# EAGLE design OrmerodController (EAGLE 7.2.0)
PanelDue 1.1
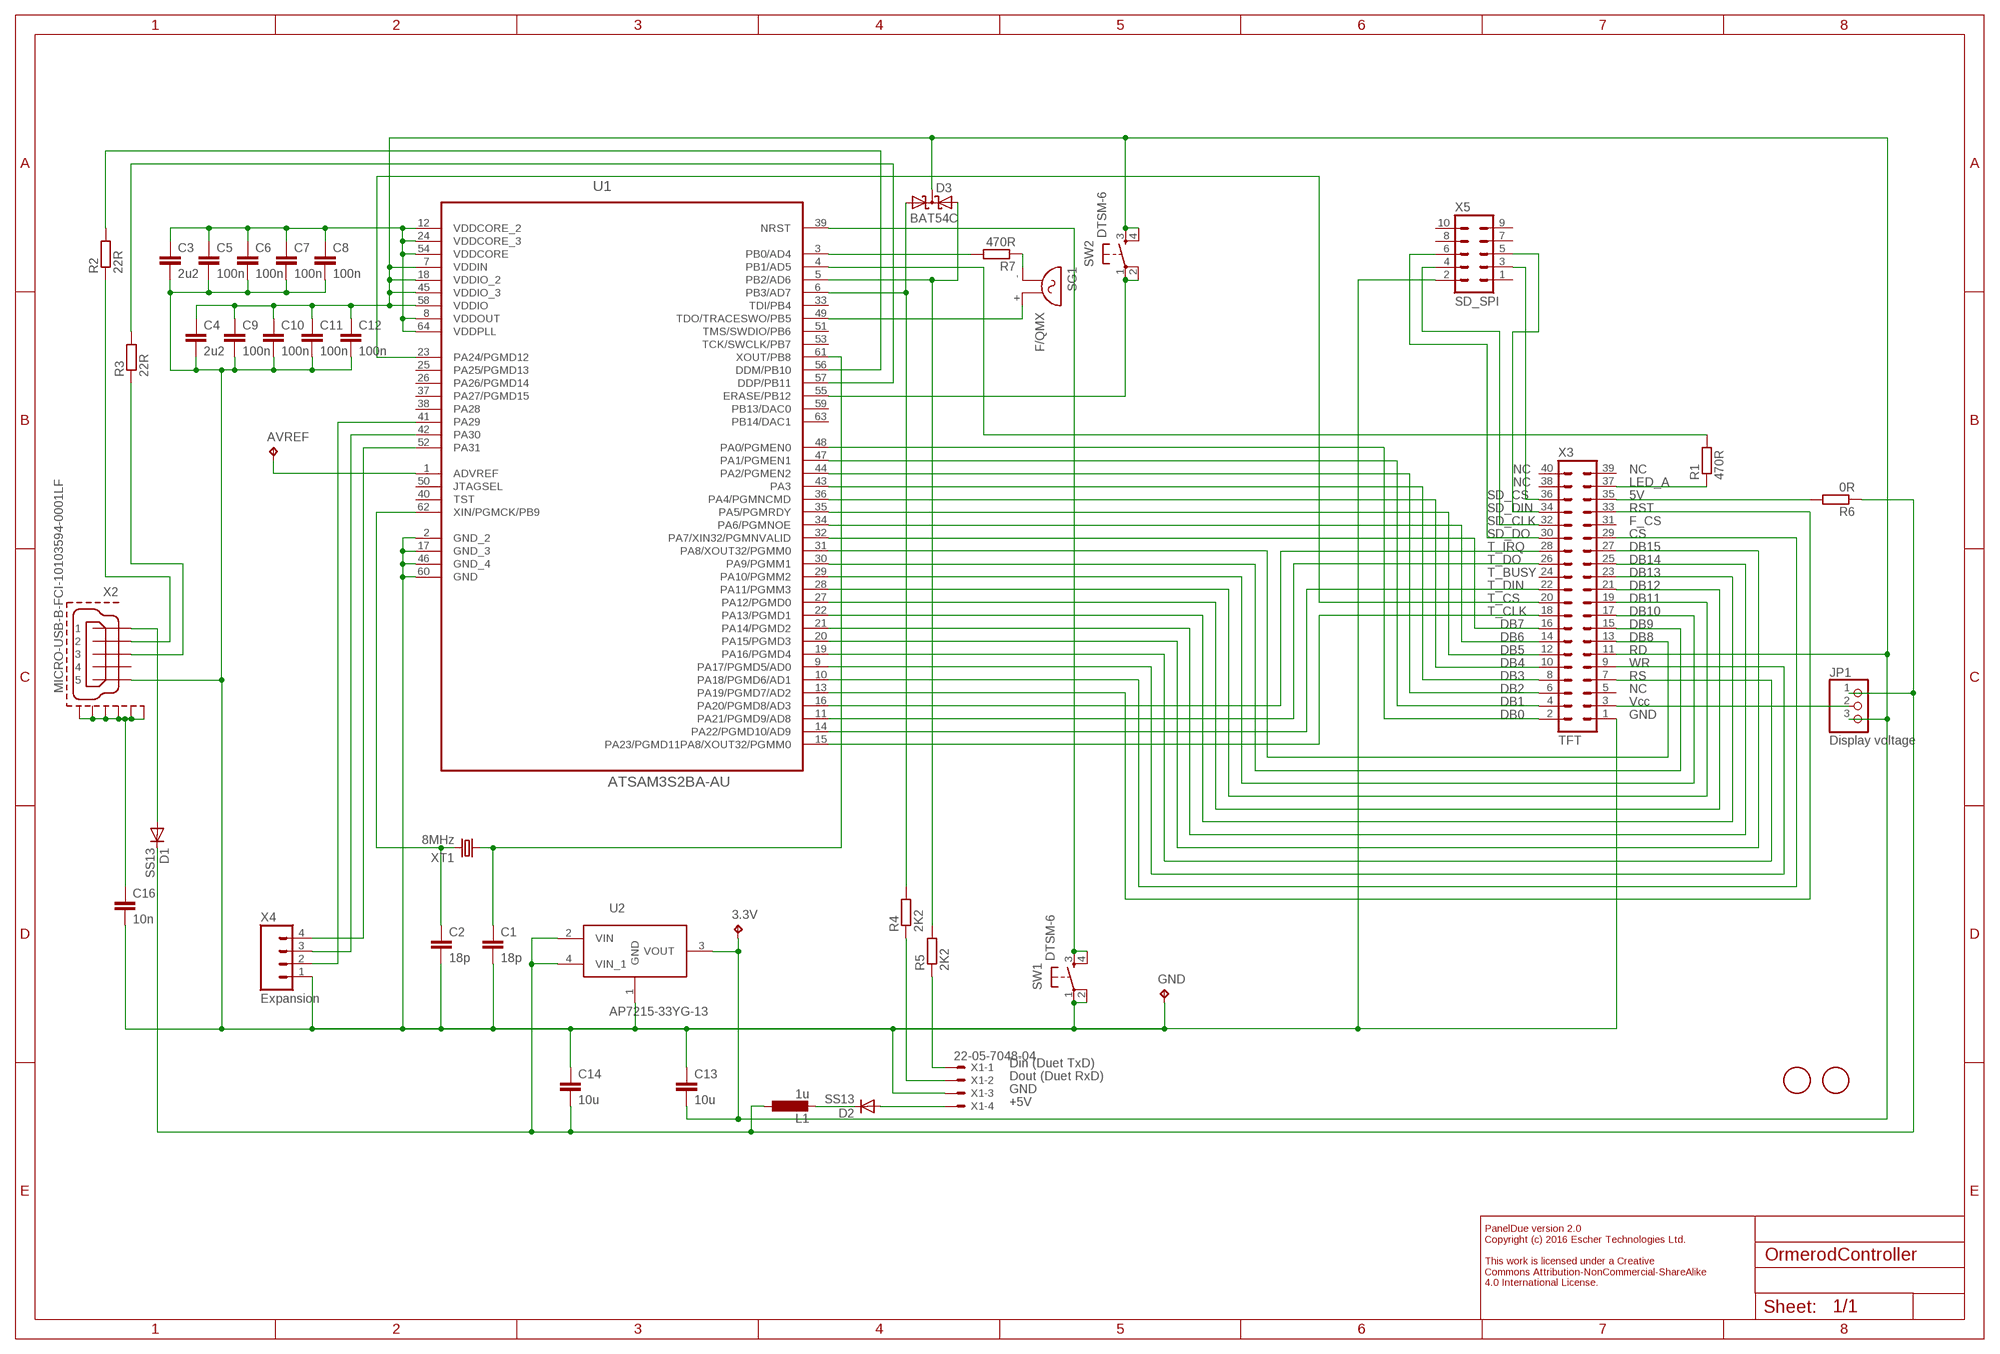
[diagram p0: schematic, sheet 1]

## Parts
3.3V  TPPAD1-10  [P1-10]
AVREF  TPPAD1-10  [P1-10]
C1  18p  C-EUC0603  [C0603]
C2  18p  C-EUC0603  [C0603]
C3  2u2  C-EUC0603  [C0603]
C4  2u2  C-EUC0603  [C0603]
C5  100n  C-EUC0603  [C0603]
C6  100n  C-EUC0603  [C0603]
C7  100n  C-EUC0603  [C0603]
C8  100n  C-EUC0603  [C0603]
C9  100n  C-EUC0603  [C0603]
C10  100n  C-EUC0603  [C0603]
C11  100n  C-EUC0603  [C0603]
C12  100n  C-EUC0603  [C0603]
C13  10u  C-EUC0805  [C0805]
C14  10u  C-EUC0805  [C0805]
C16  10n  C-EUC0603  [C0603]
D1  SS13  DIODE-DO214AC  [DO214AC]
D2  SS13  DIODE-DO214AC  [DO214AC]
D3  BAT54C  [SOT23]
GND  TPPAD1-10  [P1-10]
JP1  Display voltage  PINHD-1X3  [1X03]
L1  1u  L-EUL2012C  [L2012C]
R1  470R  R-EU_R0603  [R0603]
R2  22R  R-EU_R0603  [R0603]
R3  22R  R-EU_R0603  [R0603]
R4  2K2  R-EU_R0603  [R0603]
R5  2K2  R-EU_R0603  [R0603]
R6  0R  R-EU_R0603  [R0603]
R7  470R  R-EU_R0603  [R0603]
SG1  F/QMX  [F/QMX]
SW1  DTSM-6  [DTSM-6]
SW2  DTSM-6  [DTSM-6]
U1  ATSAM3S2BA-AU  [QFP50P1200X1200X160-64N]
U2  AP7215-33YG-13  MCP17-MCP1702T-3302E/MB  [SOT150P400X160-4N]
U$1  FIDUCIAL  [FIDUCIAL_1MM]
U$2  FIDUCIAL  [FIDUCIAL_1MM]
X1  22-05-7048-04  [7395-04]
X2  MICRO-USB-B-FCI-10103594-0001LF  [10103594-0001LF]
X3  TFT  MA20-2  [MA20-2]
X4  Expansion  M04PTH  [1X04]
X5  SD_SPI  ML10L  [ML10L]
XT1  8MHz  CRYSTALHC49UP  [HC49UP]

## Nets
GND: C1.2 C2.2 C3.2 C4.2 C5.2 C6.2 C7.2 C8.2 C9.2 C10.2 C11.2 C12.2 C13.1 C14.1 C16.2 GND.TP SW1.1 SW1.2 U1.2(GND_2) U1.17(GND_3) U1.46(GND_4) U1.60(GND) U2.1(GND) X1.3 X2.5 X3.1 X4.1 X5.2
N$1: U1.48(PA0/PGMEN0) X3.2
N$2: U1.15(PA23/PGMD11PA8/XOUT32/PGMM0) X3.18
N$3: U1.47(PA1/PGMEN1) X3.4
N$4: U1.44(PA2/PGMEN2) X3.6
N$5: U1.36(PA4/PGMNCMD) X3.10
N$6: U1.34(PA6/PGMNOE) X3.14
N$7: U1.35(PA5/PGMRDY) X3.12
N$8: U1.32(PA7/XIN32/PGMNVALID) X3.16
N$9: U1.31(PA8/XOUT32/PGMM0) X3.13
N$10: U1.43(PA3) X3.8
N$11: U1.30(PA9/PGMM1) X3.15
N$12: U1.29(PA10/PGMM2) X3.17
N$13: U1.28(PA11/PGMM3) X3.19
N$14: U1.27(PA12/PGMD0) X3.21
N$15: U1.22(PA13/PGMD1) X3.23
N$16: U1.21(PA14/PGMD2) X3.25
N$17: U1.20(PA15/PGMD3) X3.27
N$18: R2.2 U1.56(DDM/PB10)
N$19: U1.14(PA22/PGMD10/AD9) X3.22
N$20: U1.11(PA21/PGMD9/AD8) X3.26
N$21: C1.1 U1.61(XOUT/PB8) XT1.1
N$22: C2.1 U1.62(XIN/PGMCK/PB9) XT1.2
N$23: SW2.1 SW2.2 U1.55(ERASE/PB12)
N$24: U1.41(PA29) X4.2
N$25: SW1.3 SW1.4 U1.39(NRST)
N$26: D3.2(A2) R5.2 U1.5(PB2/AD6)
N$27: D3.1(A1) R4.2 U1.6(PB3/AD7)
N$28: R3.2 U1.57(DDP/PB11)
N$29: R4.1 X1.2
N$30: R5.1 X1.1
N$31: D1.A X2.1
N$32: R2.1 X2.2
N$33: R7.2 U1.3(PB0/AD4)
N$34: R3.1 X2.3
N$35: U1.23(PA24/PGMD12) X3.20
N$36: U1.16(PA20/PGMD8/AD3) X3.28
N$37: JP1.2 X3.3
N$38: R1.1 X3.37
N$39: X3.36 X5.3
N$40: R7.1 SG1.-
N$41: U1.42(PA30) X4.3
N$42: U1.52(PA31) X4.4
N$43: U1.13(PA19/PGMD7/AD2) X3.33
N$44: U1.10(PA18/PGMD6/AD1) X3.29
N$45: U1.9(PA17/PGMD5/AD0) X3.9
N$46: D2.C L1.2
N$47: C16.1 X2.GND1 X2.GND2 X2.GND3 X2.GND4 X2.GND5 X2.GND6
N$48: U1.19(PA16/PGMD4) X3.7
N$49: AVREF.TP U1.1(ADVREF)
N$50: D2.A X1.4
N$51: X3.34 X5.5
N$52: R1.2 U1.4(PB1/AD5)
N$54: SG1.+ U1.49(TDO/TRACESWO/PB5)
N$55: C3.1 C5.1 C6.1 C7.1 C8.1 U1.8(VDDOUT) U1.12(VDDCORE_2) U1.24(VDDCORE_3) U1.54(VDDCORE) U1.64(VDDPLL)
N$56: X3.32 X5.4
N$57: X3.30 X5.6
N$58: R6.2 X3.35
VCC: 3.3V.TP C4.1 C9.1 C10.1 C11.1 C12.1 C13.2 D3.3(CC) JP1.3 SW2.3 SW2.4 U1.7(VDDIN) U1.18(VDDIO_2) U1.45(VDDIO_3) U1.58(VDDIO) U2.3(VOUT) X3.11
VCC5: C14.2 D1.C JP1.1 L1.1 R6.1 U2.2(VIN) U2.4(VIN_1)
Unconnected: U1.25(PA25/PGMD13) U1.26(PA26/PGMD14) U1.33(TDI/PB4) U1.37(PA27/PGMD15) U1.38(PA28) U1.40(TST) U1.50(JTAGSEL) U1.51(TMS/SWDIO/PB6) U1.53(TCK/SWCLK/PB7) U1.59(PB13/DAC0) U1.63(PB14/DAC1) X2.4 X3.5 X3.24 X3.31 X3.38 X3.39 X3.40 X5.1 X5.7 X5.8 X5.9 X5.10

## Notes on the sheet
- NC | NC
- NC | LED_A
- SD_CS | 5V
- SD_DIN | RST
- SD_CLK | F_CS
- SD_DO | CS
- T_IRQ | DB15
- T_DO | DB14
- T_BUSY | DB13
- T_DIN | DB12
- T_CS | DB11
- T_CLK | DB10
- DB7 | DB9
- DB6 | DB8
- DB5 | RD
- DB4 | WR
- DB3 | RS
- DB2 | NC
- DB1 | Vcc
- DB0 | GND
- Din (Duet TxD)
- Dout (Duet RxD)
- GND
- +5V
- PanelDue version 2.0
  Copyright (c) 2016 Escher Technologies Ltd.
  
  This work is licensed under a Creative
  Commons Attribution-NonCommercial-ShareAlike
  4.0 International License.

## Library data of the parts
3.3V AVREF GND = testpad:TP: Test pad
C1-C14 C16 = resistor:C-EU: CAPACITOR, European symbol
D1 D2 = diode:DIODE-: DIODE
D3 = diode:BAT54C: Schottky Diodes Source: Fairchild .. BAT54.pdf
JP1 = adafruit:PINHD-1X3: PIN HEADER
L1 = resistor:L-EU: INDUCTOR, European symbol
R1-R7 = resistor:R-EU_: RESISTOR, European symbol
SG1 = buzzer:F/QMX: BUZZER Source: Buerklin; OC_FARNELL: unknown; OC_NEWARK: unknown
SW1 SW2 = switch-tact:DTSM-6
U1 = Atmel_By_element14_Batch_1-00:ATSAM3S2BA-AU: Flash MCU; DESCRIPTION: Flash MCU; MPN: ATSAM3S2BA-AU; OC_FARNELL: 1841653; OC_NEWARK: 12T1311; PACKAGE: QFP-64; SUPPLIER: Atmel
U2 = Microchip-MCP170xxxx_MB:MCP17: Low Quiescent Current LDO Regulator; MPN: MCP1702T-3302E/MB; OC_FARNELL: 1605558; OC_NEWARK: 11N7989; PACKAGE: SOT89-3; SUPPLIER: Microchip
U$1 U$2 = adafruit:FIDUCIAL: For use by pick and place machines to calibrate the vision/machine, 1mm By microbuilder.eu
X1 = con-molex:22-?-04: CONNECTOR wire to board 2.54 mm (.1 inch) pitch header; OC_FARNELL: unknown; OC_NEWARK: unknown
X2 = eschertechnologies:MICRO-USB-B-FCI-10103594-0001LF
X3 = con-lstb:MA20-2: PIN HEADER; OC_FARNELL: unknown; OC_NEWARK: unknown
X4 = SparkFun-Connectors:M04: Header 4 Standard 4-pin 0.1" header. Use with straight break away headers (SKU : PRT-00116), right angle break away headers (PRT-00553), swiss pins (PRT-00743), machine pins (PRT-00117), and female headers (PRT-00115). Molex polarized connector foot print use with SKU : PRT-08231 with associated crimp pins and housings. 1MM SMD Version SKU: PRT-10208
X5 = con-ml:ML10L: HARTING; OC_FARNELL: unknown; OC_NEWARK: unknown
XT1 = crystal:CRYSTAL: CRYSTAL; OC_FARNELL: unknown; OC_NEWARK: unknown

## Board
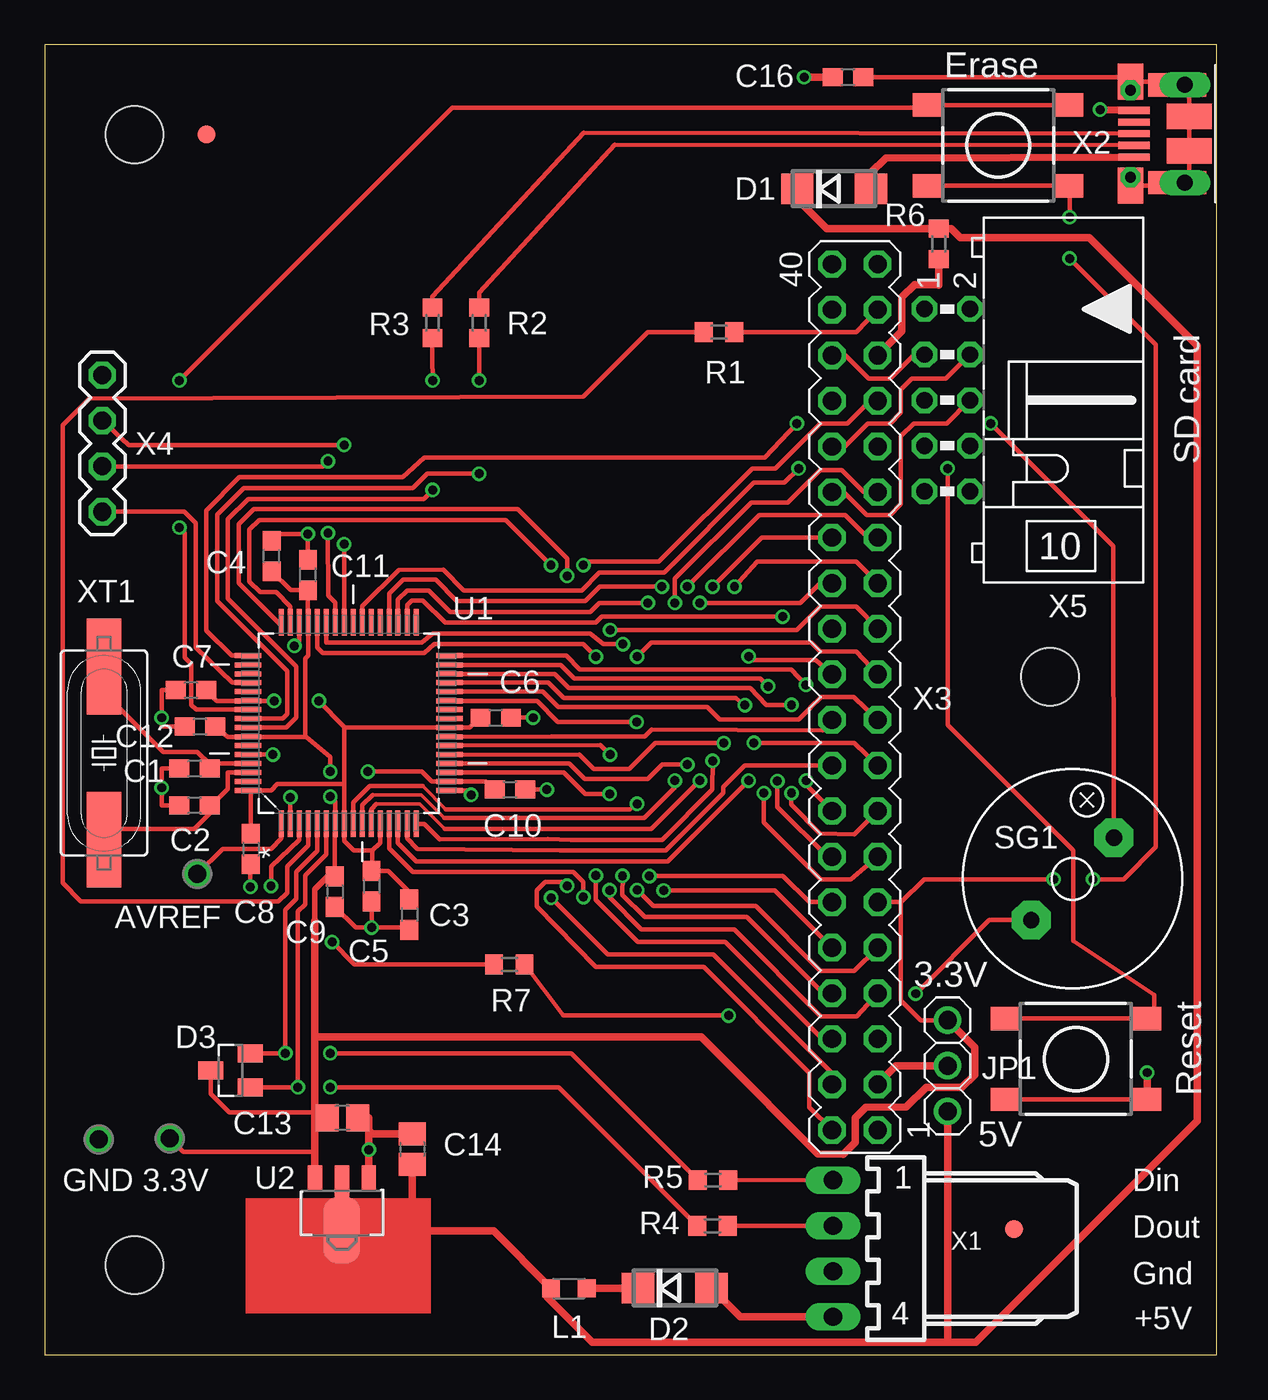
[diagram p1: board, top side]
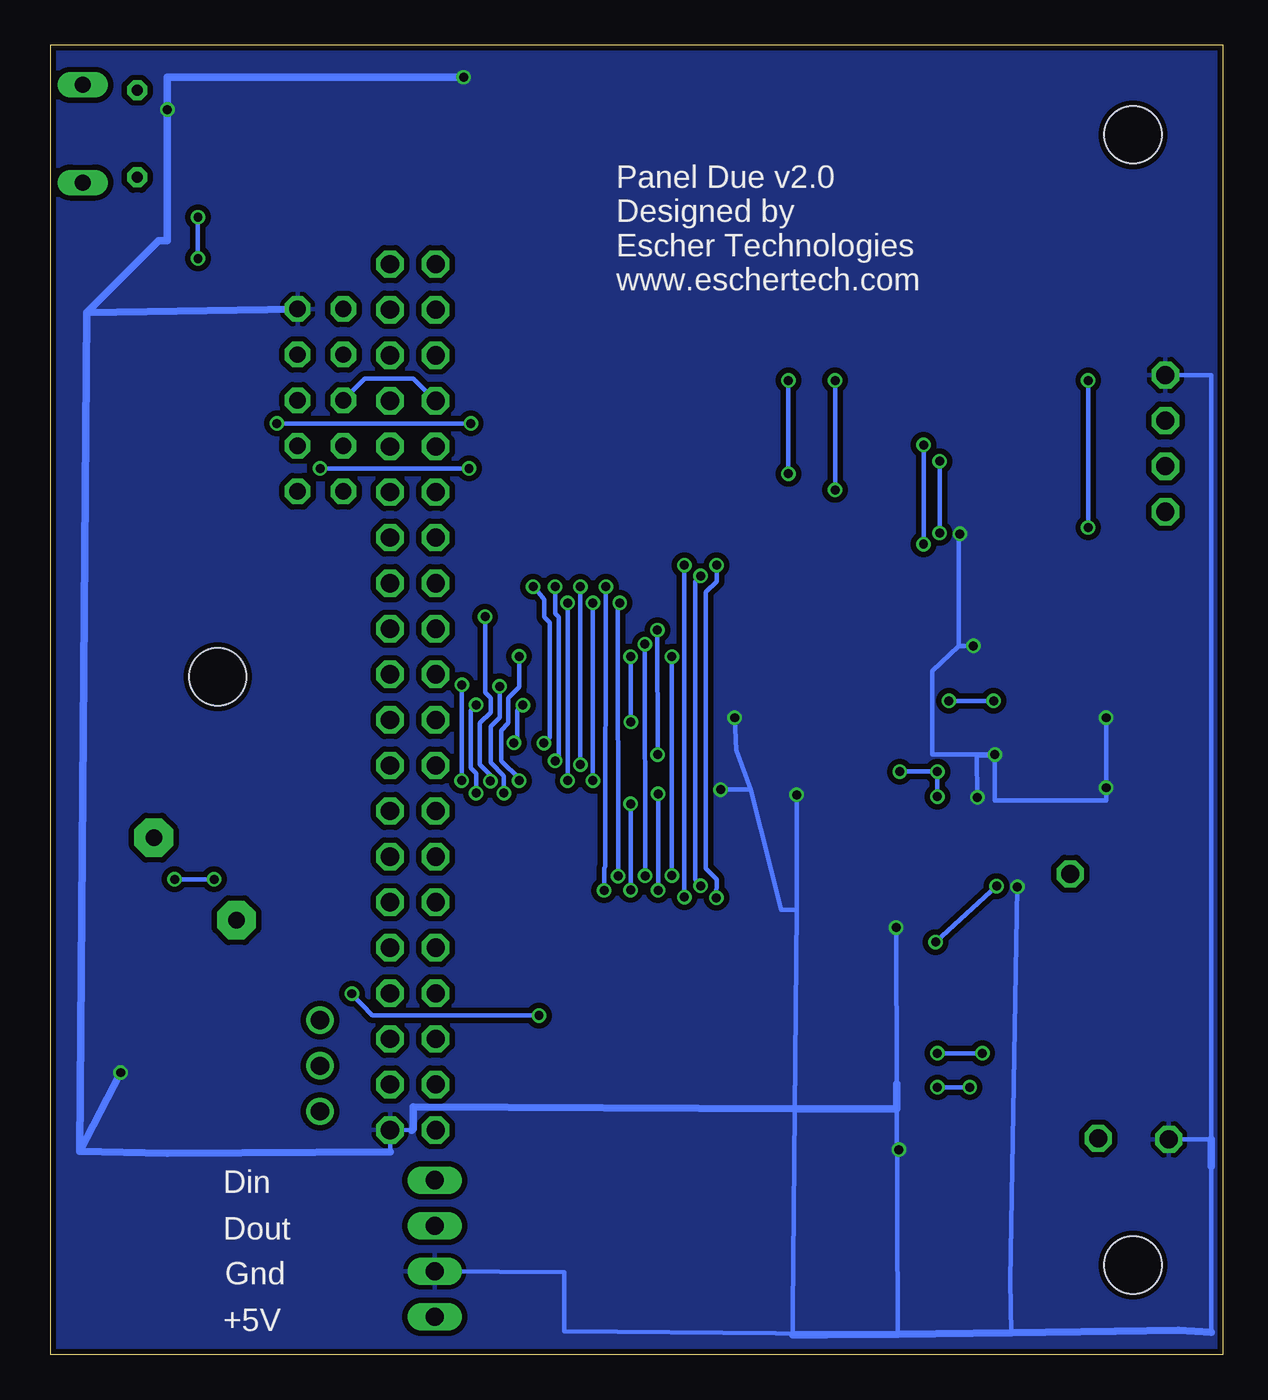
[diagram p2: board, bottom side, seen from below]

Size 65.3 x 73 mm. Coordinates in mm from the lower left corner, seen from the top.
Outline: 0,0 65.3,0 65.3,73 0,73 0,0
Copper layers (1*16): Top 0.035mm / dielectric 1.5mm / Bottom 0.035mm
Design rules "ITEADstudio_DRC *": minimum track width 6mil, minimum drill 12mil, track to track 6mil, track to pad 6mil, pad to pad 6mil, via to via 6mil, smd to smd 0mil, copper to edge 10mil, drill to drill 10mil, minimum pad ring 10mil, minimum via ring 6mil, stop-mask expansion 2mil, vias tented up to drill 100mil, thermal gap 10mil
Holes 3.2 mm at 56,37.79 5,4.99 5,67.99

### Footprints (pad centres in the part's own frame; a part is rotated, then mirrored left to right if it is on the bottom)
P1-10 = drill 1 pad 1.422 octagon: TP 0,0
C0603 = smd 1.1 x 1: 1 -0.85,0; 2 0.85,0
C0805 = smd 1.3 x 1.5: 1 -0.85,0; 2 0.85,0
DO214AC = smd 1.8 x 1.7: A 2.05,0; C -2.05,0
SOT23 = smd 1 x 1.4: 1 -0.95,-1.1; 2 0.95,-1.1; 3 0,1.1
1X03 = drill 1.016: 1 -2.54,0; 2 0,0; 3 2.54,0
L2012C = smd 1 x 1: 1 -1,0; 2 1,0
R0603 = smd 1 x 1.1: 1 -0.85,0; 2 0.85,0
F/QMX = drill 0.914 pad 2.159 octagon: + 3.251,0; - -3.251,0
DTSM-6 = smd 1.55 x 1.3: 1 -3.975,2.25; 2 3.975,2.25; 3 -3.975,-2.25; 4 3.975,-2.25
QFP50P1200X1200X160-64N = smd 1.473 x 0.279: 1 -5.613,3.759; 2 -5.613,3.251; 3 -5.613,2.743; 4 -5.613,2.261; 5 -5.613,1.753; 6 -5.613,1.245; 7 -5.613,0.762; 8 -5.613,0.254; 9 -5.613,-0.254; 10 -5.613,-0.762; 11 -5.613,-1.245; 12 -5.613,-1.753; 13 -5.613,-2.261; 14 -5.613,-2.743; 15 -5.613,-3.251; 16 -5.613,-3.759; 33 5.613,-3.759; 34 5.613,-3.251; 35 5.613,-2.743; 36 5.613,-2.261; 37 5.613,-1.753; 38 5.613,-1.245; 39 5.613,-0.762; 40 5.613,-0.254; 41 5.613,0.254; 42 5.613,0.762; 43 5.613,1.245; 44 5.613,1.753; 45 5.613,2.261; 46 5.613,2.743; 47 5.613,3.251; 48 5.613,3.759 | smd 0.279 x 1.473: 17 -3.759,-5.613; 18 -3.251,-5.613; 19 -2.743,-5.613; 20 -2.261,-5.613; 21 -1.753,-5.613; 22 -1.245,-5.613; 23 -0.762,-5.613; 24 -0.254,-5.613; 25 0.254,-5.613; 26 0.762,-5.613; 27 1.245,-5.613; 28 1.753,-5.613; 29 2.261,-5.613; 30 2.743,-5.613; 31 3.251,-5.613; 32 3.759,-5.613; 49 3.759,5.613; 50 3.251,5.613; 51 2.743,5.613; 52 2.261,5.613; 53 1.753,5.613; 54 1.245,5.613; 55 0.762,5.613; 56 0.254,5.613; 57 -0.254,5.613; 58 -0.762,5.613; 59 -1.245,5.613; 60 -1.753,5.613; 61 -2.261,5.613; 62 -2.743,5.613; 63 -3.251,5.613; 64 -3.759,5.613
SOT150P400X160-4N = smd 0.8 x 1.4: 1 -1.499,-1.981; 3 1.499,-1.981 | smd 0.8 x 1.9: 2 0,-1.727 | smd 2.032 x 3.65: 4 0,0.94
FIDUCIAL_1MM = smd 1 x 1: 1 0,0
7395-04 = drill 1.016 long: 1 3.81,0; 2 1.27,0; 3 -1.27,0; 4 -3.81,0
10103594-0001LF = smd 0.4 x 1.75: 1 -1.3,2.825; 2 -0.65,2.825; 3 0,2.825; 4 0.65,2.825; 5 1.3,2.825 | smd 2 x 1.4: GND1 -2.9,3.03; GND6 2.9,3.03 | smd 1.3 x 3.25: GND2 -2.725,0.425; GND5 2.725,0.425 | smd 1.425 x 2.5: GND3 -0.963,-0.25; GND4 0.963,-0.25 | drill 0.9 pad 1.2 long: P$1 -2.725,0; P$7 2.725,0 | drill 0.6 pad 1.05 octagon: P$3 -2.425,3.03; P$11 2.425,3.03
MA20-2 = drill 1.016 octagon: 1 -24.13,-1.27; 2 -24.13,1.27; 3 -21.59,-1.27; 4 -21.59,1.27; 5 -19.05,-1.27; 6 -19.05,1.27; 7 -16.51,-1.27; 8 -16.51,1.27; 9 -13.97,-1.27; 10 -13.97,1.27; 11 -11.43,-1.27; 12 -11.43,1.27; 13 -8.89,-1.27; 14 -8.89,1.27; 15 -6.35,-1.27; 16 -6.35,1.27; 17 -3.81,-1.27; 18 -3.81,1.27; 19 -1.27,-1.27; 20 -1.27,1.27; 21 1.27,-1.27; 22 1.27,1.27; 23 3.81,-1.27; 24 3.81,1.27; 25 6.35,-1.27; 26 6.35,1.27; 27 8.89,-1.27; 28 8.89,1.27; 29 11.43,-1.27; 30 11.43,1.27; 31 13.97,-1.27; 32 13.97,1.27; 33 16.51,-1.27; 34 16.51,1.27; 35 19.05,-1.27; 36 19.05,1.27; 37 21.59,-1.27; 38 21.59,1.27; 39 24.13,-1.27; 40 24.13,1.27
1X04 = drill 1.016 octagon: 1 0,0; 2 2.54,0; 3 5.08,0; 4 7.62,0
ML10L = drill 0.914 octagon: 1 -5.08,-1.27; 2 -5.08,1.27; 3 -2.54,-1.27; 4 -2.54,1.27; 5 0,-1.27; 6 0,1.27; 7 2.54,-1.27; 8 2.54,1.27; 9 5.08,-1.27; 10 5.08,1.27
HC49UP = smd 5.334 x 1.93: 1 -4.826,0; 2 4.826,0

### Placement (x,y rotation side)
3.3V  6.95,12.05 0 top
AVREF  8.5,26.8 180 top
C1  8.34,32.66 180 top
C2  8.34,30.62 180 top
C3  20.31,24.52 270 top
C4  12.63,44.51 90 top
C5  18.2,26.11 270 top
C6  25.12,35.5 0 top
C7  8.14,37.04 180 top
C8  11.48,28.18 270 top
C9  16.16,25.81 270 top
C10  25.92,31.49 0 top
C11  14.66,43.46 90 top
C12  8.64,35 180 top
C13  16.58,13.2 180 top
C14  20.46,11.46 270 top
C16  44.75,71.2 180 top
D1  43.98,64.97 0 top
D2  35.1,3.7 0 top
D3  10.35,15.85 90 top
GND  3,12 0 top
JP1  50.3,16.1 90 top
L1  29.2,3.7 0 top
R1  37.56,56.99 180 top
R2  24.2,57.5 270 top
R3  21.59,57.52 270 top
R4  37.2,7.18 180 top
R5  37.23,9.73 180 top
R6  49.8,61.9 270 top
R7  25.88,21.75 180 top
SG1  57.26,26.52 45 top
SW1  57.44,16.48 180 top
SW2  53.12,67.4 0 top
U1  16.93,35.2 90 top
U2  16.55,7.88 180 top
U$1  9,68 0 top
U$2  54,7 0 top
X1  43.91,5.92 90 top
X2  63.52,68.05 90 top
X3  45.13,36.65 90 top
X4  3.2,54.6 270 top
X5  50.27,53.2 270 top
XT1  3.29,33.53 270 top

### Tracks (layer width: path | path; a pad name or v marks a point on that pad's centre or on a via)
GND  (via drill 0.5, 0.5 pad 0.25)
  Top 0.254: U1.2 13.68,29.65 v13.68,31.06 | U1.46 14.19,39.79 v13.9,39.5 | U1.60 v12.7,33.45 | C5.2 v18.2,23.8 | C9.2 16.2,25.36 | v27.2,35.5 C6.2 | C11.2 14.66,45.05 v14.65,45.75 12.66,45.75 C4.2 | C9.2 16.24,24.96 | v18.2,23.8 17.32,23.8 C9.2 | v18.05,11.43 18.05,11.3 | C13.1 18.05,13.2 | SW1.2 SW1.1 | C3.2 20.31,23.8 v18.2,23.8 | v11.45,26.07 11.45,27.3 C8.2 | U1.17 23.51,31.44 v23.75,31.2 | C10.2 v27.98,31.49 | C7.2 6.5,37.04 v6.5,35.5 6.5,35 C12.2 | C1.2 6.5,32.66 v6.5,31.6 6.5,30.62 C2.2
  Top 0.406: 18.05,11.3 U2.1 | 18.05,13.2 v18.05,11.43 18.05,12.4 18.15,12.4 18.15,12.3 C14.1 | X2.5 v58.8,69.4 | v61.41,15.72 SW1.1 | C16.2 v42.3,71.2
  Bottom 0.254: 45.2,12.5 X3.1 46.4,11.3 | 12.7,33.4 v12.7,33.45 16.2,33.45 16.2,38.1 14.7,39.5 | 12.7,33.4 13.7,33.4 v13.68,31.06 | 14.7,39.5 v13.9,39.5 | v6.5,35.5 v6.5,31.6 6.5,30.9 12.7,30.9 12.7,33.4 | X1.3 36.68,4.6 36.68,1.3 24.92,1.2 22.1,1.12 | v18.2,23.8 | v18.2,23.8 18.16,15.1 18.1,1.12 | v11.45,26.07 11.85,4.13 11.8,1.23 | v23.75,31.2 23.75,24.8 | 23.75,24.8 23.95,2.42 23.95,1.12 | v27.2,35.5 27.1,33.7 26.3,31.49 | 26.3,31.49 24.6,24.8 23.75,24.8 | v27.98,31.49 26.3,31.49 | v14.65,45.75 14.7,45.75 14.7,39.5 | X4.1 0.63,54.6 0.63,12 GND.TP | 0.63,10.5 0.63,1.24
  Bottom 0.406: 45.2,12.5 45.12,12.58 45.12,13.8 23.9,13.7 18.16,13.7 18.16,15.1 | 23.95,1.12 22.1,1.12 18.1,1.12 11.8,1.23 5.99,1.3 2.49,1.35 0.63,1.24 | 46.4,11.3 58.82,11.22 63.7,11.32 | 63.7,11.32 v61.41,15.72 | 63.3,58.08 59.28,62.1 58.8,62.1 v58.8,69.4 58.8,71.2 v42.3,71.2 | 63.3,58.08 63.7,11.32 | X5.2 63.3,58.08 | 0.63,12 0.63,10.5
  pour Bottom (isolate 0.305): 0.2,72.8 65.1,72.8 65.1,0.2 0.2,0.2
N$1  (via drill 0.5)
  Top 0.254: U1.48 13.17,40.63 10.8,43 10.8,46.29 11.64,47.14 26.33,47.14 29.1,44.37 v29.1,43.4 | v29.1,26.14 28.89,26.35 27.88,26.35 27.41,25.89 27.4,25 30.7,21.6 36.7,21.6 42.6,15.7 42.6,13.78 X3.2
  Bottom 0.254: v29.1,26.14 29.4,26.5 29.4,43.1 v29.1,43.4
N$2
  Top 0.254: U1.15 20.19,28.76 20.75,28.2 28.7,28.1 34.6,28.1 37.8,31.3 37.8,31.65 38.99,32.84 | 38.99,32.84 39,32.85 | X3.18 38.99,32.84
N$3  (via drill 0.5)
  Top 0.254: U1.47 13.68,41.71 12.89,42.5 12,42.5 11.4,43.1 11.4,45.98 11.94,46.52 25.69,46.52 v28.2,44 | v28.21,25.46 31.38,22.3 37.25,22.3 43.85,15.7 X3.4
  Bottom 0.254: v28.2,44 28.2,43.1 28.8,42.5 28.8,27.1 28.2,26.5 v28.21,25.46
N$4  (via drill 0.5)
  Top 0.254: U1.44 15.18,39.4 15.48,39.1 21.14,39.11 21.7,39.6 30,39.6 v30.7,38.9 | v30.7,26.7 30.7,25.34 33.04,23 37.9,23 43.32,17.6 X3.6
  Bottom 0.254: v30.7,38.9 v30.7,26.7
N$5  (via drill 0.5)
  Top 0.254: U1.36 19.2,40.82 19.2,42.42 19.98,43.2 21.77,43.2 22.95,42 30.1,42 30.91,42.81 v34.38,42.81 | v34.48,25.88 40.67,25.88 X3.10
  Bottom 0.254: v34.38,42.81 34.4,27.2 34.48,27.12 v34.48,25.88
N$6  (via drill 0.5)
  Top 0.254: U1.34 20.18,41.77 20.45,42.04 21.06,42.04 22.3,40.8 30.7,40.8 31.04,41.14 v41.1,41.14 | v40.81,31.96 40.82,30.53 43.59,27.76 X3.14
  Bottom 0.254: v41.1,41.14 41.1,36.9 40.8,36.6 40.8,35.8 41.4,35.2 41.4,32.9 40.81,32.31 v40.81,31.96
N$7  (via drill 0.5)
  Top 0.254: U1.35 19.67,42.08 20.2,42.6 21.4,42.6 22.6,41.4 30.4,41.4 30.9,41.9 v33.6,41.9 | v33.69,26.68 41.12,26.68 42.58,25.22 X3.12
  Bottom 0.254: v33.6,41.9 33.7,41.8 v33.69,26.68
N$8  (via drill 0.5)
  Top 0.254: U1.32 29.04,38.96 29.8,38.2 41.6,38.2 v42.4,37.34 | v42.41,32 42.41,31.75 X3.16
  Bottom 0.254: v42.4,37.34 v42.41,32
N$9  (via drill 0.5)
  Top 0.254: U1.31 28.75,38.45 29.5,37.7 39.85,37.7 v40.3,37.25 | v40.06,31.3 40.06,29.67 43.23,26.5 44.9,26.5 X3.13
  Bottom 0.254: v40.3,37.25 40.3,35.5 40.8,35 40.8,33 40.06,32.26 v40.06,31.3
N$10  (via drill 0.5)
  Top 0.254: U1.43 15.69,39.7 21,39.7 21.6,40.2 30.4,40.2 31.1,39.6 v32.2,39.6 | v32.19,26.69 32.18,25.64 33.42,24.4 39.1,24.4 43.36,20.14 X3.8
  Bottom 0.254: v32.2,39.6 v32.19,26.69
N$11  (via drill 0.5)
  Top 0.254: U1.30 28.01,37.94 28.41,37.94 29.2,37.15 39.3,37.16 40.2,36.21 v41.6,36.21 | v41.6,31.3 41.6,30.67 43.17,29.05 45.1,29 X3.15
  Bottom 0.254: v41.6,36.21 41.9,35.91 41.9,32.7 41.6,32.4 v41.6,31.3
N$12  (via drill 0.5)
  Top 0.254: X3.17 45.1,34.1 v39.5,34.1 | v39,36.2 38.52,36.58 38.5,36.6 28.9,36.6 28.04,37.46 U1.29
  Bottom 0.254: v39,36.2 39.3,35.9 39.3,34.3 v39.5,34.1
N$13
  Top 0.254: U1.28 27.75,36.95 28.6,36.1 36.9,36.1 37.6,35.4 42,35.4 42.66,36.06 42.65,36.06 43.25,36.66 45.06,36.66 X3.19
N$14  (via drill 0.5)
  Top 0.254: U1.27 24.45,36.45 27.27,36.42 27.44,36.42 28.59,35.27 28.86,35.27 v32.98,35.26 | X3.21 45.2,39.2 43.2,39.2 42.7,39.7 33.8,39.7 v33,38.9
  Bottom 0.254: v32.98,35.26 v33,38.9
N$15  (via drill 0.5)
  Top 0.254: U1.22 30.95,33.98 31.49,33.42 v31.49,33.45 | v31.5,40.39 41.2,40.4 41.9,40.4 43.2,41.7 45.2,41.7 X3.23
  Bottom 0.254: v31.49,33.45 v31.5,40.39
N$16  (via drill 0.5)
  Top 0.254: U1.21 23.15,33.44 29.77,33.45 30.59,32.64 32.53,32.63 32.56,32.64 34.01,34.09 v37.83,34.09 | X3.25 45.2,44.2 39.7,44.2 v38.42,42.8
  Bottom 0.254: v37.83,34.09 37.81,34.09 37.5,34.4 37.5,40.8 37.8,41.1 37.8,42.1 38.4,42.8 v38.42,42.8
N$17  (via drill 0.5)
  Top 0.254: U1.20 29.23,32.95 30.09,32.09 33.59,32.09 34.39,32.89 v35.8,32.89 | X3.27 45.86,45.54 44.6,46.8 39.8,46.8 v35.8,42.8
  Bottom 0.254: v35.8,32.89 v35.8,42.8
N$18  (via drill 0.5)
  Top 0.254: U1.56 13.25,35.45 13.3,35.5 | 13.25,35.45 13.3,35.5 | 13.3,35.5 13.5,35.7 13.5,38.1 9.6,42 9.6,46.81 11.09,48.3 20.5,48.3 21.3,49.1 v24.2,49.1 | R2.2 24.2,55.41 v24.2,54.3
  Bottom 0.254: v24.2,49.1 v24.2,54.3
N$19  (via drill 0.5)
  Top 0.254: U1.14 19.67,28.53 20.7,27.5 34.71,27.5 v39.21,32 | X3.22 42.96,38.73 39.41,38.73 v39.21,38.92
  Bottom 0.254: v39.21,32 39.21,32.11 40.2,33.1 40.2,34.8 39.8,35.2 39.8,36.6 39.2,37.2 v39.21,38.92
N$20  (via drill 0.5)
  Top 0.2: 18.48,30.7 20.88,30.7 22.27,29.3
  Top 0.254: U1.11 18.18,30.4 18.48,30.7 | 22.27,29.3 33.8,29.3 v36.5,32 | v36.5,41.9 42.1,41.9 43.2,43 X3.26
  Bottom 0.254: v36.5,41.9 v36.5,32
N$21
  Top 0.254: U1.61 9.3,32.94 8.99,32.94 | 2.49,36.8 2.86,37.52 | 2.86,37.52 XT1.1 | C1.1 9.19,32.91 8.5,33.6 6.58,33.6 2.86,37.32 2.86,37.52
  Top 0.406: 9.19,32.91 9.3,32.91 9.3,32.94
N$22
  Top 0.254: U1.62 10.2,32.46 10.2,31.54 9.26,30.6 9.19,30.6 C2.1 | 9.06,30.6 8.99,30.6 C2.1 | C2.1 9.19,30.15 8.34,29.3 2.96,29.3 2.96,29.08 | 2.7,29.3 2.7,29.4 2.69,29.4 2.96,29.08 | 2.96,29.08 XT1.2
N$23  (via drill 0.5)
  Top 0.254: U1.55 8.44,35.96 8.15,36.2 8.15,38.51 7.8,38.85 7.8,45.8 v7.5,46.1 | SW2.2 SW2.1 48.3,69.5 22.7,69.5 v7.5,54.3
  Bottom 0.254: v7.5,46.1 v7.5,54.3
N$24  (via drill 0.5)
  Top 0.254: v16.68,45.18 U1.41 | v16.68,50.7 4.66,50.7 X4.2
  Bottom 0.254: v16.68,50.7 v16.68,45.18
N$25  (via drill 0.5)
  Top 0.254: U1.39 17.69,41.73 19.7,43.75 22.2,43.75 23.35,42.6 29.9,42.6 30.9,43.6 34.5,43.6 39.5,48.6 41.2,48.6 v42,49.4 | SW1.3 SW1.4 | v50.3,49.4 50.3,36.34 50.3,36.15 | 61.8,18.73 61.8,20.06 57.3,23.06 57.3,28.1 50.3,35.1 50.3,36.15 | 50.3,36.15
  Top 0.406: 61.8,18.73 SW1.3
  Bottom 0.254: v42,49.4 v50.3,49.4
N$26  (via drill 0.5)
  Top 0.254: U1.5 15.18,28.08 14,26.9 14,25.4 13.4,24.8 v13.4,16.8 D3.2 | v15.9,16.8 29.32,16.8 R5.2
  Bottom 0.254: v13.4,16.8 v15.9,16.8
N$27  (via drill 0.5)
  Top 0.254: U1.6 15.69,27.89 14.5,26.7 14.5,25.1 14.1,24.7 v14.1,14.9 D3.1 | v15.9,14.9 28.63,14.9 R4.2
  Bottom 0.254: v14.1,14.9 v15.9,14.9
N$28  (via drill 0.5)
  Top 0.254: U1.57 13.45,34.95 14,35.5 14,38.35 10.2,42.15 10.2,46.57 11.33,47.7 21.1,47.7 v21.6,48.2 | v21.6,54.3 21.59,55.6 R3.2
  Bottom 0.254: v21.6,48.2 v21.6,54.3
N$29
  Top 0.254: X1.2 R4.1
N$30
  Top 0.254: X1.1 R5.1
N$31
  Top 0.406: X2.1 46.84,66.7 46.02,65.89 D1.A
N$32
  Top 0.254: X2.2 31.77,67.45 24.2,59.19 R2.1
N$33  (via drill 0.5)
  Top 0.254: v12.6,26.12 12.6,27.2 14.19,28.69 U1.3 | R7.2 17.23,21.75 v16,23
  Bottom 0.254: v12.6,26.12 v16,23
N$34
  Top 0.254: X2.3 30.02,68.1 21.59,58.97 R3.1
N$35
  Top 0.254: U1.23 28.23,34.45 33.42,34.45 33.83,34.85 43.34,34.8 43.88,35.4 X3.20
N$36  (via drill 0.5)
  Top 0.254: 21.07,29.59 U1.16 21.14,29.59 22,28.73 28.02,28.73 29.3,28.7 29.8,28.7 34.4,28.7 37.2,31.5 v37.2,33.1 | v37.2,42.8 39.94,45.54 X3.28
  Bottom 0.254: v37.2,42.8 37.2,41.3 37,41.1 37,33.3 v37.2,33.1
N$37
  Top 0.406: X3.3 46.4,15.1 47.4,16.1 JP1.2
N$38
  Top 0.254: X3.37 45.22,57 R1.1
N$39
  Top 0.254: X3.36 44.6,55.7 45.9,54.4 47.1,54.4 48.4,55.7 48.97,55.7 X5.3
N$40  (via drill 0.5)
  Top 0.254: v38.1,18.9 28.89,18.9 R7.1 | v48.52,20.12 52.62,24.22 SG1.-
  Bottom 0.254: v48.52,20.12 47.4,18.9 v38.1,18.9
N$41  (via drill 0.5)
  Top 0.254: U1.42 16.17,41.93 15.8,42.3 v15.78,45.79 | v15.78,49.8 15.47,49.5 3.2,49.5 X4.3
  Bottom 0.254: v15.78,45.79 v15.78,49.8
N$42
  Top 0.254: U1.52 10.44,37.46 8.4,39.4 8.4,46.35 7.77,46.98 X4.4
N$43  (via drill 0.5)
  Top 0.254: U1.13 19.19,28.21 20.5,26.9 29.43,26.9 30,26.33 v30,25.5 | v30,44 30.2,44.2 34.2,44.2 39.4,49.4 40.7,49.4 43.2,51.9 44.7,51.9 45.96,53.16 X3.33
  Bottom 0.254: v30,44 v30,25.5
N$44  (via drill 0.5)
  Top 0.2: 18.26,31.2 20.96,31.2 22.26,29.9
  Top 0.254: U1.10 17.69,30.63 18.26,31.2 | X3.29 45.62,48.08 44.4,49.3 43.2,49.3 41.4,47.5 39.34,47.5 35.1,43.26 v35.1,41.9 | 22.26,29.9 33.4,29.9 35.1,31.6 v35.1,32
  Bottom 0.254: v35.1,41.9 v35.1,32
N$45  (via drill 0.5)
  Top 0.2: 21.05,31.7 22.35,30.4
  Top 0.254: U1.9 17.18,30.78 18.1,31.7 21.05,31.7 | 22.35,30.4 32.6,30.4 v33,30.7 | v33,25.9 33.9,25 39.6,25 43.2,21.4 45.1,21.4 X3.9
  Bottom 0.254: v33,30.7 v33,25.9
N$46
  Top 0.406: D2.C L1.2
N$47
  Top 0.254: C16.1 60.24,71.2 X2.GND6 62.92,70.95 X2.GND5 63.77,70.1 X2.GND4 X2.GND3 | 63.09,67.11 63.2,67 63.2,67.09 X2.GND3 | X2.GND1 62.92,65.15 X2.GND2 63.2,65.43 63.77,65.43 X2.GND3
N$48  (via drill 0.5)
  Top 0.254: U1.19 23.66,32.46 28.9,32.45 30.1,31.26 v31.46,31.26 | v31.46,25.89 31.46,25.48 33.24,23.7 38.4,23.7 43.23,18.85 45.25,18.85 X3.7
  Bottom 0.254: v31.46,31.26 v31.46,25.89
N$49
  Top 0.254: U1.1 13.17,28.77 12.6,28.2 9.9,28.2 AVREF.TP
N$50
  Top 0.406: X1.4 38.74,2.1 D2.A
N$51
  Bottom 0.254: X3.34 45.12,54.4 47.8,54.4 X5.5
N$52
  Top 0.254: U1.4 14.67,28.37 13.5,27.2 13.5,25.74 13.02,25.26 2.23,25.27 2.01,25.27 1,26.28 1,51.82 2.47,53.3 29.99,53.39 33.59,56.99 R1.2
N$54  (via drill 0.5)
  Top 0.254: U1.49 10.4,38.96 9,40.36 9,47.06 10.84,48.9 19.95,48.9 21.15,50 40.1,50 v41.9,51.9 | SG1.+ 59.52,44.49 59.52,45.08 v52.7,51.9
  Bottom 0.254: v41.9,51.9 v52.7,51.9
N$55  (via drill 0.5)
  Top 0.254: 18.25,28.1 | C7.1 9.59,36.45 U1.54 11.34,36.44 v12.78,36.44 | C6.1 23.67,34.95 U1.24 16.68,34.95 | 16.68,31.8 12.96,31.8 12.6,31.44 U1.64 11.48,31.44 C8.1 | v15.26,36.44 16.65,35 16.68,34.97 16.68,34.95 | 18.25,28.1 17.2,28.1 16.68,28.62 U1.8 16.68,31.8 | C5.1 18.25,26.96 | 18.25,26.96 18.25,28.1 | 18.25,26.96 19.14,26.96 20.3,25.8 C3.1 | 16.68,31.8 16.68,34.95 | 18.25,28.1 18.68,28.53 U1.12
  Bottom 0.254: v15.26,36.44 v12.78,36.44
N$56
  Top 0.254: X5.4 50.2,54.4 48.3,54.4 47.7,53.8 47.7,52.5 47.1,51.9 45.86,51.9 44.58,50.62 X3.32
N$57
  Top 0.254: X3.30 44.52,48.08 45.8,46.8 47.1,46.8 47.7,47.4 47.7,51.2 48.4,51.9 50.24,51.9 X5.6
N$58
  Top 0.406: X3.35 47.75,57.05 47.75,58.95 48.45,59.64 49.8,59.62 R6.2
VCC  (via drill 0.5)
  Top 0.254: C12.1 10.19,34.44 U1.58 14.5,34.44 | C10.1 24.57,31.95 U1.18 22.01,31.95 21.55,31.95 21,32.5 v18,32.5 | 14.5,34.44 14.56,34.44 15.9,33.3 v15.9,32.5 | 15.77,26.66 C9.1 U1.7 16.17,30.83 v15.9,31.1 | 12.74,43.46 12.56,43.64 C4.1 13.71,42.61 C11.1 U1.45 14.67,38.97 14.5,38.8 14.5,34.44 | SW2.3 SW2.4 v57.1,63.4 | C13.2 15.2,13.2 15.05,13.2 | 15.04,24.17 15.05,24.17 | X3.11 47.7,25.22 | 47.7,25.22 47.7,19.74 48.8,18.64 JP1.3 | v57.1,61.1 61.9,56.3 61.9,28.3 60.1,26.5 v58.4,26.5 | D3.3 9.25,14.53 10.28,13.5 15.05,13.5 | 3.3V.TP 7.7,11.3 15.05,11.3 | 47.7,25.22 47.72,25.22 49,26.5 v56.2,26.5
  Top 0.305: 15.77,26.66 15.04,25.94 15.04,24.17
  Top 0.406: U2.3 15.05,11.3 15.05,13.2 | JP1.3 51.8,17.14 51.8,15.61 51.09,14.9 49.1,14.9 48,13.8 45.73,13.78 45.15,13.19 45.15,11.83 44.5,11.18 43.07,11.18 37.6,16.67 36.57,17.7 15.05,17.7 | 15.05,24.17 15.05,17.7 | 15.05,17.7 15.05,13.5 15.05,13.2 15.2,13.2
  Bottom 0.254: v18,32.5 v15.9,32.5 v15.9,31.1 | v56.2,26.5 v58.4,26.5 | v57.1,61.1 v57.1,63.4
VCC5
  Top 0.254: 16.49,6.9 U2.4
  Top 0.406: U2.2 U2.4 20.4,6.94 | 20.46,6.9 25,6.9 L1.1 28.2,3.6 28,3.6 28,3.21 30.51,0.7 50.3,0.7 | 20.46,6.9 16.49,6.9 | 50.3,0.7 51.86,0.7 64.2,13.04 64.2,56.23 58.18,62.25 51,62.25 50.5,62.75 R6.1 43.58,62.75 41.92,64.4 D1.C | JP1.1 50.3,0.7 | C14.2 20.46,6.9
(copper drawn outside any net)
  shapes: Top area x1

### Text on the board
tNames: Erase | SD card | 3.3V | Reset | 5V | Din | Dout | Gnd | +5V
bNames: Panel Due v2.0 / Designed by / Escher Technologies / www.eschertech.com | Din | Dout | Gnd | +5V